# EAGLE design hasp_interface (EAGLE 9.6.2)

## Sheet 1 of 2: INTERFACE / PWR
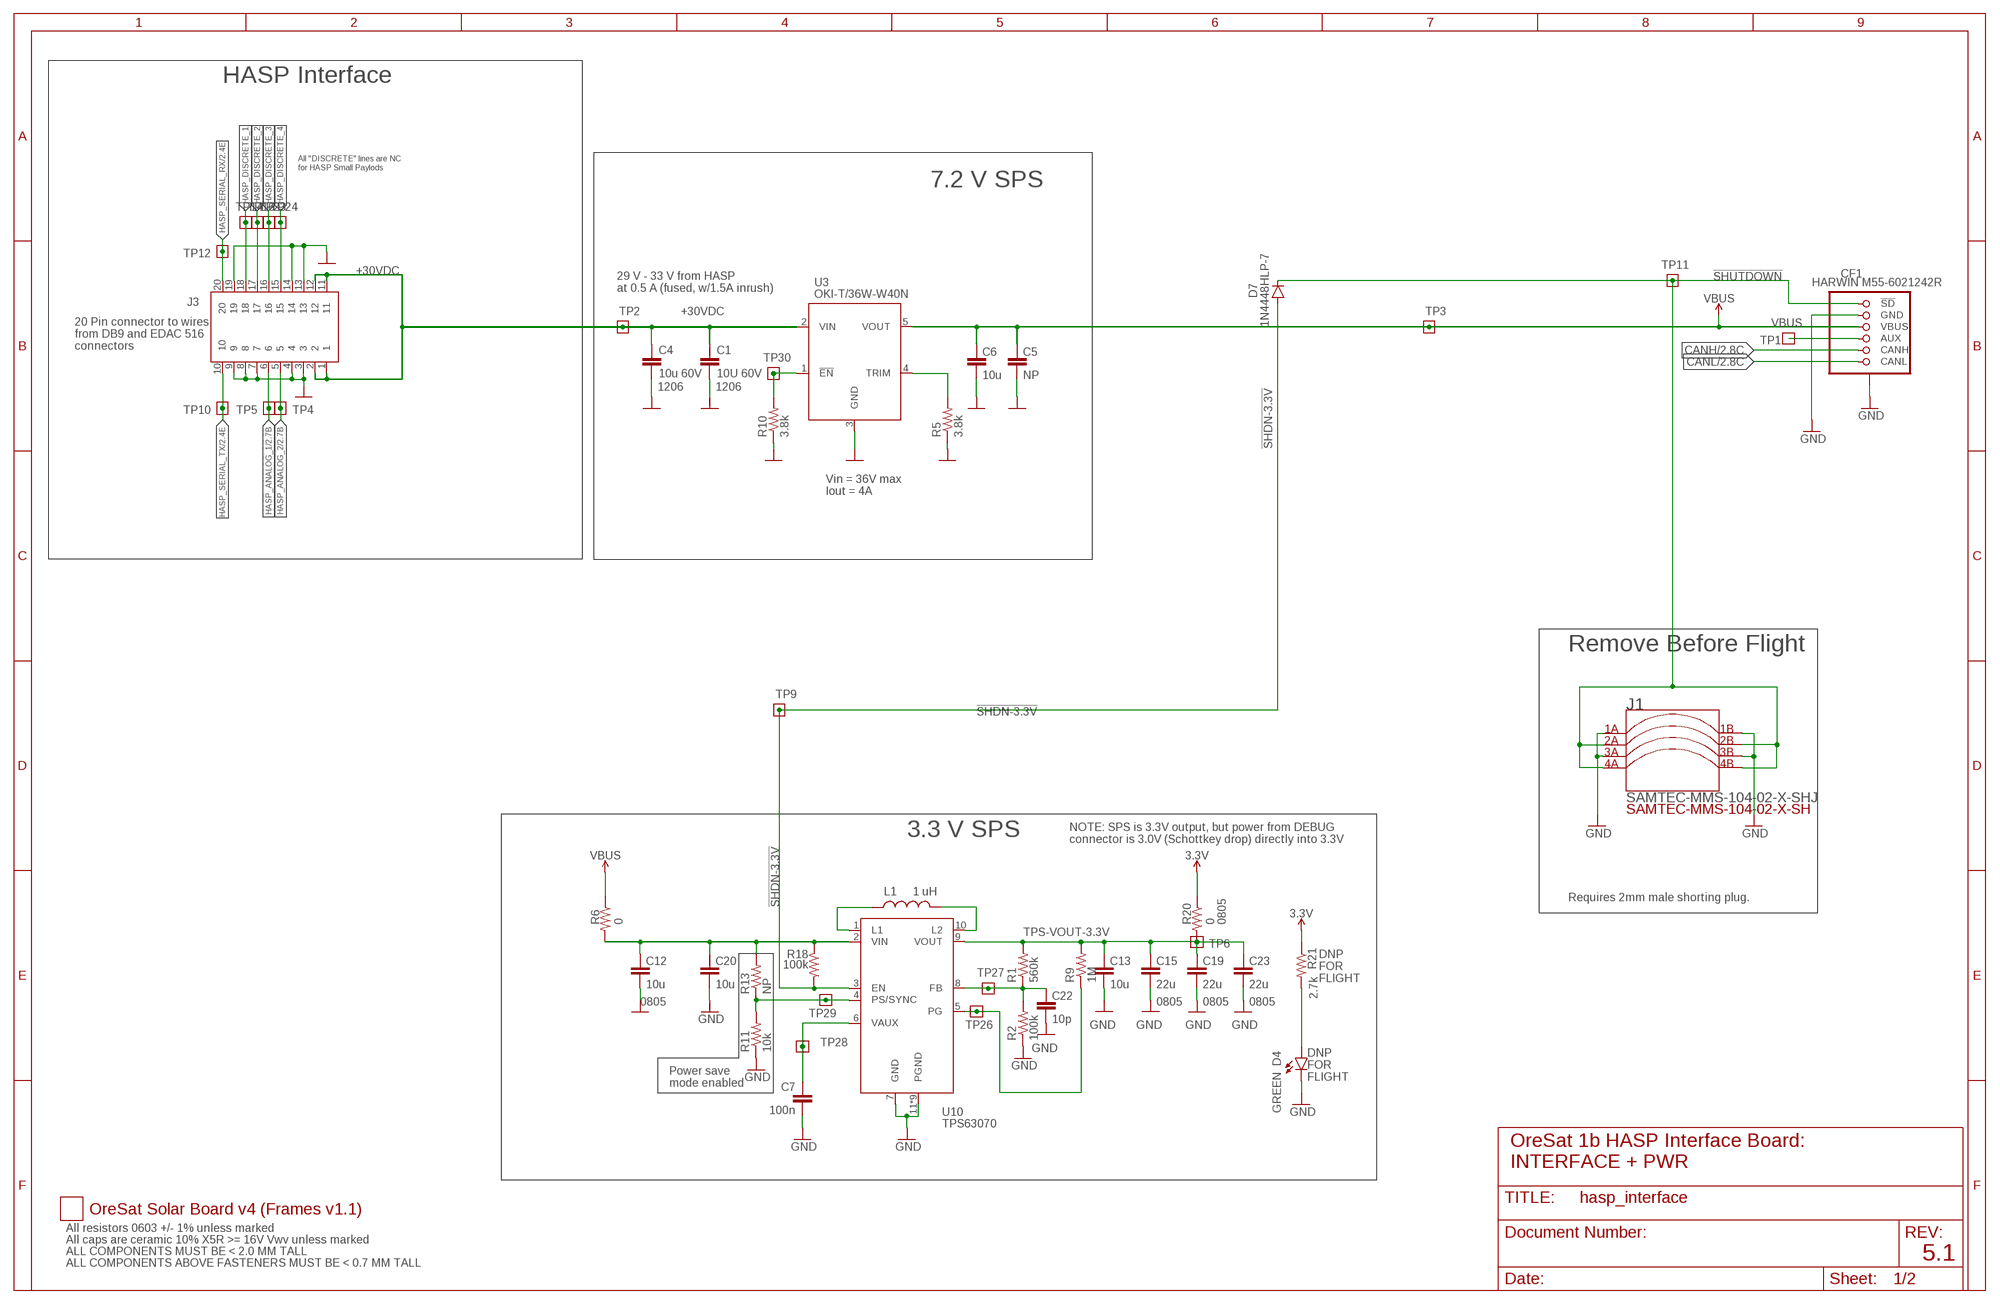
[diagram p0: schematic, sheet 1]

### Parts
C1  10U 60V  C-EU1206-C  [1206-C]
C4  10u 60V  C-EU1206-C  [1206-C]
C5  NP  C-EU0603-C-NOSILK  [.0603-C-NOSILK]
C6  10u  C-EU0603-C-NOSILK  [.0603-C-NOSILK]
C7  100n  C-EU0603-C-NOSILK  [.0603-C-NOSILK]
C12  10u  C-EU0805-B-NOSILK  [.0805-B-NOSILK]
C13  10u  C-EU0603-C-NOSILK  [.0603-C-NOSILK]
C15  22u  C-EU0805-B-NOSILK  [.0805-B-NOSILK]
C19  22u  C-EU0805-B-NOSILK  [.0805-B-NOSILK]
C20  10u  C-EU0603-C-NOSILK  [.0603-C-NOSILK]
C22  10p  C-EU0603-C-NOSILK  [.0603-C-NOSILK]
C23  22u  C-EU0805-B-NOSILK  [.0805-B-NOSILK]
CF1  HARWIN M55-6021242R  SOLAR-BOARD-CONNECTOR  [HARWIN-M55-60X1242R]
D4  GREEN  LED-GREEN0603  [LED-0603]
D7  1N4448HLP-7  D-0402  [.0402-B-NOSILK-DIODE]
J1  SAMTEC-MMS-104-02-X-SHJ  [SAMTEC-MMS-104-02-X-SH]
J3  MOLEX-43045XXXXRIGHTANGLE  [0430452000]
L1  1 uH  L-MURATA-1226AS-H-1R0N=P2  [IND_1226AS-H-1R0N=P2]
PCB1  ORESAT-SOLAR-BOARD-V4-SPECTROLABS  [ORESAT-SOLAR-BOARD-V4]
R1  560k  R-US_0603-C-NOSILK  [.0603-C-NOSILK]
R2  100k  R-US_0603-C-NOSILK  [.0603-C-NOSILK]
R5  3.8k  R-US_0603-C-NOSILK  [.0603-C-NOSILK]
R6  0  R-US_0805-C-NOSILK  [.0805-C-NOSILK]
R9  1M  R-US_0603-C-NOSILK  [.0603-C-NOSILK]
R10  3.8k  R-US_0603-C-NOSILK  [.0603-C-NOSILK]
R11  10k  R-US_0603-C-NOSILK  [.0603-C-NOSILK]
R13  NP  R-US_0603-C-NOSILK  [.0603-C-NOSILK]
R18  100k  R-US_0603-C-NOSILK  [.0603-C-NOSILK]
R20  0  R-US_0805-C-NOSILK  [.0805-C-NOSILK]
R21  2.7k  R-US_0603-C-NOSILK  [.0603-C-NOSILK]
TP1  TEST-POINT-LARGE-SQUARE  [1X01]
TP2  TEST-POINT-LARGE-SQUARE  [1X01]
TP3  TEST-POINT-LARGE-SQUARE  [1X01]
TP4  TEST-POINT-LARGE-SQUARE  [1X01]
TP5  TEST-POINT-LARGE-SQUARE  [1X01]
TP6  TEST-POINT-LARGE-SQUARE  [1X01]
TP9  TEST-POINT-LARGE-SQUARE  [1X01]
TP10  TEST-POINT-LARGE-SQUARE  [1X01]
TP11  TEST-POINT-LARGE-SQUARE  [1X01]
TP12  TEST-POINT-LARGE-SQUARE  [1X01]
TP14  TEST-POINT-LARGE-SQUARE  [1X01]
TP16  TEST-POINT-LARGE-SQUARE  [1X01]
TP23  TEST-POINT-LARGE-SQUARE  [1X01]
TP24  TEST-POINT-LARGE-SQUARE  [1X01]
TP26  TEST-POINT-LARGE-SQUARE  [1X01]
TP27  TEST-POINT-LARGE-SQUARE  [1X01]
TP28  TEST-POINT-LARGE-SQUARE  [1X01]
TP29  TEST-POINT-LARGE-SQUARE  [1X01]
TP30  TEST-POINT-LARGE-SQUARE  [1X01]
U3  OKI-T/36W-W40N  OKI-T/36W-W40  [OKI-T/36W-W40]
U10  TPS63070  U-TI-TPS63060DCT-BUCKBOOST  [CONV_TPS63060DSCT]

### Nets
3.3V: R20.1 R21.1 ; also sheet 2
!SHDN-3.3V: D7.A R18.2 TP9.1 U10.3(EN)
!SHUTDOWN: CF1.1(!SD) CF1.2(!SD) D7.C J1.2A J1.2B J1.4A J1.4B TP11.1
+30VDC: C1.1 C4.1 J3.1 J3.2 J3.11 J3.12 TP2.1 U3.2(VIN)
AUX: CF1.7(AUX) CF1.8(AUX) TP1.1
CANH: CF1.9(CANH) CF1.10(CANH) ; also sheet 2
CANL: CF1.11(CANL) CF1.12(CANL) ; also sheet 2
GND: C1.2 C4.2 C5.2 C6.2 C7.2 C12.2 C13.2 C15.2 C19.2 C20.2 C22.2 C23.2 CF1.3(GND) CF1.4(GND) CF1.P$1(SHIELD) CF1.P$2(SHIELD) CF1.P$3(SHIELD) CF1.P$4(SHIELD) D4.C J1.1A J1.1B J1.3A J1.3B J3.3 J3.4 J3.7 J3.8 J3.9 J3.13 J3.14 J3.19 R2.1 R5.1 R10.1 R11.1 U3.3(GND) U10.7(GND) U10.11(PGND) U10.12(PGND) U10.13(PGND) U10.14(PGND) U10.15(PGND) U10.16(PGND) U10.17(PGND) U10.18(PGND) U10.19(PGND) ; also sheet 2
HASP_ANALOG_1: J3.6 TP5.1 ; also sheet 2
HASP_ANALOG_2: J3.5 TP4.1 ; also sheet 2
HASP_DISCRETE_1: J3.18 TP14.1
HASP_DISCRETE_2: J3.17 TP16.1
HASP_DISCRETE_3: J3.16 TP23.1
HASP_DISCRETE_4: J3.15 TP24.1
HASP_SERIAL_RX: J3.20 TP12.1 ; also sheet 2
HASP_SERIAL_TX: J3.10 TP10.1 ; also sheet 2
N$2: R5.2 U3.4(TRIM)
N$5: R10.2 TP30.1 U3.1(!EN)
N$14: D4.A R21.2
TPS-EN: R11.2 R13.1 TP29.1 U10.4(PS/SYNC)
TPS-FB: C22.1 R1.1 R2.2 TP27.1 U10.8(FB)
TPS-L1: L1.1 U10.1(L1)
TPS-L2: L1.2 U10.10(L2)
TPS-PG: R9.1 TP26.1 U10.5(PG)
TPS-VAUX: C7.1 TP28.1 U10.6(VAUX)
TPS-VIN: C12.1 C20.1 R6.2 R13.2 R18.1 U10.2(VIN)
TPS-VOUT-3.3V: C13.1 C15.1 C19.1 C23.1 R1.2 R9.2 R20.2 TP6.1 U10.9(VOUT)
VBUS: C5.1 C6.1 CF1.5(VBUS) CF1.6(VBUS) R6.1 TP3.1 U3.5(VOUT)

### Notes on the sheet
- HASP Interface
- All "DISCRETE" lines are NC
  for HASP Small Paylods
- 7.2 V SPS
- 29 V - 33 V from HASP
  at 0.5 A (fused, w/1.5A inrush)
- OKI-T/36W-W40N
- 20 Pin connector to wires 
  from DB9 and EDAC 516 
  connectors
- 1206 | 1206
- Vin = 36V max
  Iout = 4A
- Remove Before Flight
- 3.3 V SPS
- NOTE: SPS is 3.3V output, but power from DEBUG
  connector is 3.0V (Schottkey drop) directly into 3.3V
- Requires 2mm male shorting plug.
- 0805
- DNP
  FOR
  FLIGHT
- 0805 | 0805 | 0805 | 0805
- DNP
  FOR
  FLIGHT
- Power save
  mode enabled
- OreSat 1b HASP Interface Board:
  INTERFACE + PWR
- All resistors 0603 +/- 1% unless marked
- All caps are ceramic 10% X5R >= 16V Vwv unless marked
- ALL COMPONENTS MUST BE < 2.0 MM TALL
- 5.1
- ALL COMPONENTS ABOVE FASTENERS MUST BE < 0.7 MM TALL

## Sheet 2 of 2: Microcontroller
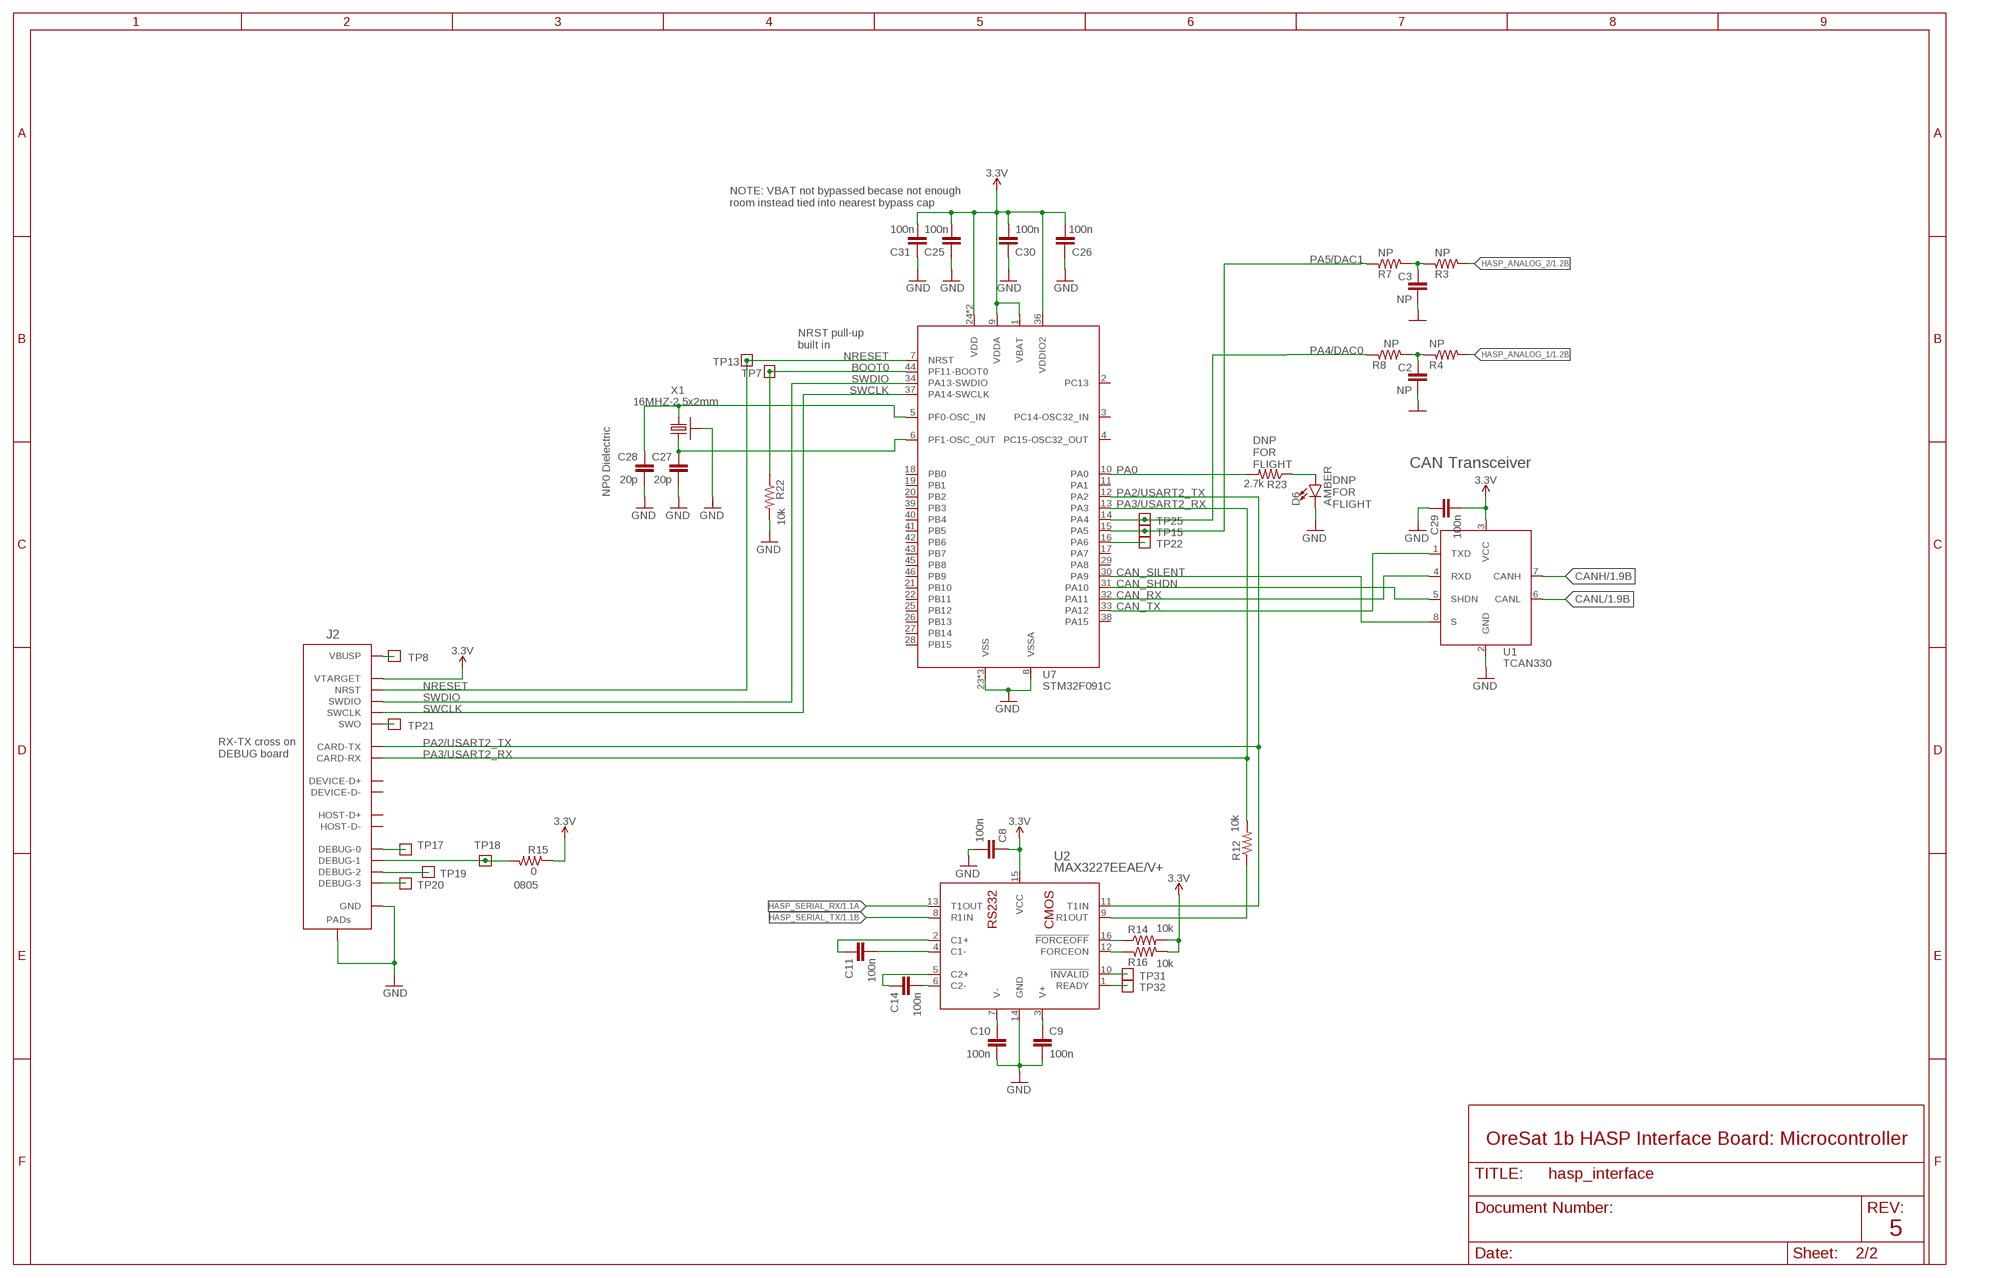
[diagram p1: schematic, sheet 2]

### Parts
C2  NP  C-EU0603-C-NOSILK  [.0603-C-NOSILK]
C3  NP  C-EU0603-C-NOSILK  [.0603-C-NOSILK]
C8  100n  C-EU0603-C-NOSILK  [.0603-C-NOSILK]
C9  100n  C-EU0603-C-NOSILK  [.0603-C-NOSILK]
C10  100n  C-EU0603-C-NOSILK  [.0603-C-NOSILK]
C11  100n  C-EU0603-C-NOSILK  [.0603-C-NOSILK]
C14  100n  C-EU0603-C-NOSILK  [.0603-C-NOSILK]
C25  100n  C-EU0603-C-NOSILK  [.0603-C-NOSILK]
C26  100n  C-EU0603-C-NOSILK  [.0603-C-NOSILK]
C27  20p  C-EU0603-C-NOSILK  [.0603-C-NOSILK]
C28  20p  C-EU0603-C-NOSILK  [.0603-C-NOSILK]
C29  100n  C-EU0603-C-NOSILK  [.0603-C-NOSILK]
C30  100n  C-EU0603-C-NOSILK  [.0603-C-NOSILK]
C31  100n  C-EU0603-C-NOSILK  [.0603-C-NOSILK]
D6  AMBER  LED-GREEN0603  [LED-0603]
J2  ORESAT-DEBUG-CONNECTOR-ALL  [TE_2-1734592-0]
R3  NP  R-US_0603-C-NOSILK  [.0603-C-NOSILK]
R4  NP  R-US_0603-C-NOSILK  [.0603-C-NOSILK]
R7  NP  R-US_0603-C-NOSILK  [.0603-C-NOSILK]
R8  NP  R-US_0603-C-NOSILK  [.0603-C-NOSILK]
R12  10k  R-US_0603-C-NOSILK  [.0603-C-NOSILK]
R14  10k  R-US_0603-C-NOSILK  [.0603-C-NOSILK]
R15  0  R-US_0805-C-NOSILK  [.0805-C-NOSILK]
R16  10k  R-US_0603-C-NOSILK  [.0603-C-NOSILK]
R22  10k  R-US_0603-C-NOSILK  [.0603-C-NOSILK]
R23  2.7k  R-US_0603-C-NOSILK  [.0603-C-NOSILK]
TP7  TEST-POINT-LARGE-SQUARE  [1X01]
TP8  TEST-POINT-LARGE-SQUARE  [1X01]
TP13  TEST-POINT-LARGE-SQUARE  [1X01]
TP15  TEST-POINT-LARGE-SQUARE  [1X01]
TP17  TEST-POINT-LARGE-SQUARE  [1X01]
TP18  TEST-POINT-LARGE-SQUARE  [1X01]
TP19  TEST-POINT-LARGE-SQUARE  [1X01]
TP20  TEST-POINT-LARGE-SQUARE  [1X01]
TP21  TEST-POINT-LARGE-SQUARE  [1X01]
TP22  TEST-POINT-LARGE-SQUARE  [1X01]
TP25  TEST-POINT-LARGE-SQUARE  [1X01]
TP31  TEST-POINT-LARGE-SQUARE  [1X01]
TP32  TEST-POINT-LARGE-SQUARE  [1X01]
U1  TCAN330  [SOT23-8_TI-DCN]
U2  MAX3227EEAE/V+  [21-0056_A16+2_MXM]
U7  STM32F091C  [STM32F091C]
X1  16MHZ-2.5x2mm  CRYSTAL-WITH-GND  [CRYSTAL_2.5X2]

### Nets
3.3V: C8.1 C25.2 C26.2 C29.2 C30.2 C31.2 J2.11(VTARGET) R14.2 R15.1 R16.2 U1.3(VCC) U2.15(VCC) U7.1(VBAT) U7.9(VDDA) U7.24(VDD) U7.36(VDDIO2) U7.48(VDD) ; also sheet 1
BOOT0: R22.1 TP7.1 U7.44(PF11-BOOT0)
CAN_RX: U1.4(RXD) U7.32(PA11)
CAN_SHDN: U1.5(SHDN) U7.31(PA10)
CAN_SILENT: U1.8(S) U7.30(PA9)
CAN_TX: U1.1(TXD) U7.33(PA12)
CANH: U1.7(CANH) ; also sheet 1
CANL: U1.6(CANL) ; also sheet 1
DEBU-1/SOLAR3V: J2.18(DEBUG-1) R15.2 TP18.1
DEBUG-0: J2.17(DEBUG-0) TP17.1
DEBUG-2: J2.19(DEBUG-2) TP19.1
DEBUG-3: J2.20(DEBUG-3) TP20.1
GND: C2.2 C3.2 C8.2 C9.2 C10.2 C25.1 C26.1 C27.2 C28.2 C29.1 C30.1 C31.1 D6.C J2.3(GND) J2.6(GND) J2.9(GND) J2.PAD1(PAD) J2.PAD2(PAD) R22.2 U1.2(GND) U2.14(GND) U7.8(VSSA) U7.23(VSS) U7.35(VSS) U7.47(VSS) X1.2(SHIELD) X1.4(SHIELD) ; also sheet 1
HASP_ANALOG_1: R4.2 ; also sheet 1
HASP_ANALOG_2: R3.2 ; also sheet 1
HASP_SERIAL_RX: U2.13(T1OUT) ; also sheet 1
HASP_SERIAL_TX: U2.8(R1IN) ; also sheet 1
N$1: J2.1(VBUSP) J2.2(VBUSP) TP8.1
N$3: C3.1 R3.1 R7.2
N$4: C2.1 R4.1 R8.2
N$6: R14.1 U2.16(!FORCEOFF)
N$7: C10.1 U2.7(V-)
N$8: C9.1 U2.3(V+)
N$9: C14.2 U2.6(C2-)
N$10: C14.1 U2.5(C2+)
N$11: C11.2 U2.4(C1-)
N$12: C11.1 U2.2(C1+)
N$13: R12.1 U2.9(R1OUT)
N$15: R16.1 U2.12(FORCEON)
N$17: TP31.1 U2.10(!INVALID)
N$18: TP32.1 U2.1(READY)
N$19: D6.A R23.1
NRESET: J2.10(NRST) TP13.1 U7.7(NRST)
PA0: R23.2 U7.10(PA0)
PA2/USART2_TX: J2.13(CARD-TX) U2.11(T1IN) U7.12(PA2)
PA3/USART2_RX: J2.12(CARD-RX) R12.2 U7.13(PA3)
PA4/DAC0: R8.1 TP25.1 U7.14(PA4)
PA5/DAC1: R7.1 TP15.1 U7.15(PA5)
PA6: TP22.1 U7.16(PA6)
SWCLK: J2.15(SWCLK) U7.37(PA14-SWCLK)
SWDIO: J2.14(SWDIO) U7.34(PA13-SWDIO)
SWO: J2.16(SWO) TP21.1
XTAL1-IN: C28.1 U7.5(PF0-OSC_IN) X1.1
XTAL1-OUT: C27.1 U7.6(PF1-OSC_OUT) X1.3
Unconnected: J2.4(DEVICE-D+) J2.5(DEVICE-D-) J2.7(HOST-D+) J2.8(HOST-D-) U7.2(PC13) U7.3(PC14-OSC32_IN) U7.4(PC15-OSC32_OUT) U7.11(PA1) U7.17(PA7) U7.18(PB0) U7.19(PB1) U7.20(PB2) U7.21(PB10) U7.22(PB11) U7.25(PB12) U7.26(PB13) U7.27(PB14) U7.28(PB15) U7.29(PA8) U7.38(PA15) U7.39(PB3) U7.40(PB4) U7.41(PB5) U7.42(PB6) U7.43(PB7) U7.45(PB8) U7.46(PB9)

### Notes on the sheet
- NOTE: VBAT not bypassed becase not enough 
  room instead tied into nearest bypass cap
- NRST pull-up
  built in
- CAN Transceiver
- DNP
  FOR
  FLIGHT
- NP0 Dielectric
- DNP
  FOR
  FLIGHT
- RX-TX cross on
  DEBUG board
- 0805
- OreSat 1b HASP Interface Board: Microcontroller
- 5

## Library data of the parts
C1 C4 = oresat-rcl:C-EU: CAPACITOR, European symbol
C2 C3 C5 C6 C13 C20 C22 = oresat-rcl:C-EU: CAPACITOR, European symbol; DIS: Digi-Key; DPN: 490-12317-1-ND; MFR: Murata; MPN: GRT188R61C106KE13D
C7-C11 C14 C25 C26 C29-C31 = oresat-rcl:C-EU: CAPACITOR, European symbol; DIS: Digi-Key; DPN: 1276-6985-1-ND; MFR: Kemet; MPN: CL10B104KB85PND
C12 = oresat-rcl:C-EU: CAPACITOR, European symbol; DIS: Digi-Key; DPN: 490-12379-2-ND; MFR: Murata; MPN: GRT21BR61C106KE01L
C15 C19 C23 = oresat-rcl:C-EU: CAPACITOR, European symbol; DIS: Digi-Key; DPN: 1276-6817-1-ND; MFR: Samsung; MPN: CL32B226KOJVPNE
C27 C28 = oresat-rcl:C-EU: CAPACITOR, European symbol; DIS: Digi-Key; DPN: 490-11157-2-ND; MFR: Murata; MPN: GCM1885C2A200JA16D
CF1 = J-Harwin-M55-60X1242R-Solar-board-connector:SOLAR-BOARD-CONNECTOR: OreSat Solar Board Connector This 12 pin 1.27 mm vertical connector (Harwin M55-6021242R) is used on the OreSat 1U solar panels to connect to the end cards.; DIS: DIGIKEY; DPN: M55-6021242R; MFR: HARWIN; MPN: M55-6021242R
D4 = SparkFun-LED:LED-GREEN: Green SMD LED Used in manufacturing of various products at SparkFun Packages: 0603 - SMD 0603 package [Product Link] <http://www.futureelectronics.com/en/technologies/semiconductors/optoelectronics/leds/Pages/9894312-LTST-C190GKT.aspx?CrossPart=HSMG-C190&IM=0> LilyPad 1206 - SMD1206 LilyPad package [Product Link] <http://www.futureelectronics.com/en/Technologies/Product.aspx?ProductID=IN150NGHARVATEKCORPORATION2049943&IM=0> 1206 - SMD1206 package [Product Link] <http://www.futureelectronics.com/en/technologies/semiconductors/optoelectronics/leds/Pages/8315665-LTST-C150KGKT.aspx?IM=0> 1206 Bottom Mount -SMD 1206 Bottom Mount [Product Link] <http://www.digikey.com/product-detail/en/lite-on-inc/LTST-C230KGKT/160-1456-1-ND/386854> SparkFun Products: Pro Mini 328 -5V <https://www.sparkfun.com/products/821> RedBoard <https://www.sparkfun.com/products/12757> MP3 Trigger <https://www.sparkfun.com/products/13720> Makey Makey <https://www.sparkfun.com/products/11076>; DIS: Digi-Key; DPN: 1830-1064-1-ND; MFR: Inolux; MPN: IN-S63AT5A
D6 = SparkFun-LED:LED-GREEN: Green SMD LED Used in manufacturing of various products at SparkFun Packages: 0603 - SMD 0603 package [Product Link] <http://www.futureelectronics.com/en/technologies/semiconductors/optoelectronics/leds/Pages/9894312-LTST-C190GKT.aspx?CrossPart=HSMG-C190&IM=0> LilyPad 1206 - SMD1206 LilyPad package [Product Link] <http://www.futureelectronics.com/en/Technologies/Product.aspx?ProductID=IN150NGHARVATEKCORPORATION2049943&IM=0> 1206 - SMD1206 package [Product Link] <http://www.futureelectronics.com/en/technologies/semiconductors/optoelectronics/leds/Pages/8315665-LTST-C150KGKT.aspx?IM=0> 1206 Bottom Mount -SMD 1206 Bottom Mount [Product Link] <http://www.digikey.com/product-detail/en/lite-on-inc/LTST-C230KGKT/160-1456-1-ND/386854> SparkFun Products: Pro Mini 328 -5V <https://www.sparkfun.com/products/821> RedBoard <https://www.sparkfun.com/products/12757> MP3 Trigger <https://www.sparkfun.com/products/13720> Makey Makey <https://www.sparkfun.com/products/11076>; DIS: Digi-Key; DPN: 1830-1064-1-ND; MFR: Inolux; MPN: IN-S63AT5A; VALUE: GREEN
D7 = D-0402-package:D-0402; DIS: Digi-Key; DPN: 1N4448HLPDICT-ND; MFR: Diodes Inc; MPN: 1N4448HLP-7
J1 = J-Samtec-MMS-104-02-X-SH-smt-0.1-ra:SAMTEC-MMS-104-02-X-SH
J2 = oresat-debug-connector:ORESAT-DEBUG-CONNECTOR; DIS: Digi-Key; DPN: 732-11341-1-ND; MFR: Wurth; MPN: 687120183622
J3 = J-Molex-043045XXXX-Dual-Row-Connector:MOLEX-43045XXXX
L1 = L-Wurth-1226ASH1R0NP2:L-MURATA-1226AS-H-1R0N=P2; DIS: Digi-Key; DPN: 445-VLS3010CX-1R5M-1CT-ND; MFR: TDK; MPN: VLS3010CX-1R5M-1
PCB1 = oresat-solar-board:ORESAT-SOLAR-BOARD-V4
R1 = oresat-rcl:R-US_: RESISTOR, American symbol; DIS: Digi-Key; DPN: A129720CT-ND; MFR: TE; MPN: CRGCQ0603F470K
R2 = oresat-rcl:R-US_: RESISTOR, American symbol; DIS: Digi-Key; DPN: RR08P100KDCT-ND; MFR: Susumu; MPN: RR0816P-104-D
R3-R5 R7-R11 = oresat-rcl:R-US_: RESISTOR, American symbol
R6 R15 R20 = oresat-rcl:R-US_: RESISTOR, American symbol; DIS: Digi-Key; DPN: RMCF0805ZT0R00CT-ND; MFR: Stackpole; MPN: RMCF0805ZT0R00
R12 R14 R16 R21-R23 = oresat-rcl:R-US_: RESISTOR, American symbol; DIS: Digi-Key; DPN: A129693CT-ND; MFR: TE; MPN: CRGCQ0603F2K7
R13 R18 = oresat-rcl:R-US_: RESISTOR, American symbol; DIS: Digi-Key; DPN: RNCP0603FTD10K0CT-ND; MFR: Stackpole; MPN: RNCP0603FTD10K0
TP1-TP32 = oresat-misc:TEST-POINT-LARGE-SQUARE
U1 = TCAN330:TCAN330; DIS: Digi-Key; DPN: 296-44211-1-ND; MFR: Texas Instruments; MPN: TCAN330GDCNT
U2 = U-Maxim-MAX3227-RS232-transceiver-driver:MAX3227EEAE/V+; BUILT_BY: EMA_UL_Team; MANUFACTURER_PART_NUMBER: MAX3227EEAE/V+; REVISION: 4; SOURCELIBRARY: Update_to_database_2021-06-01; VENDOR: Maxim Integrated Products
U3 = U-Murata-OKI-T36-W40-DC-DC-Converter:OKI-T/36W-W40
U7 = U-ST-STM32F091C-uC:STM32F091C; DIS: Digi-Key; DPN: 497-18749-1-ND; MFR: STMicroelectronics; MPN: STM32F091CCT6TR
U10 = U-TI-TPS63060DSCT-buck-boost:U-TI-TPS63060DCT-BUCKBOOST; DIS: Digi-Key; DPN: 296-44764-1-ND; MFR: Texas Instruments; MPN: TPS63070RNMT
X1 = low-gain-radio:CRYSTAL-WITH-GND; DIS: Digi-Key; DPN: XC2181CT-ND; MFR: ECS Inc.; MPN: ECS-160-10-36Q-ES-TR

## Board
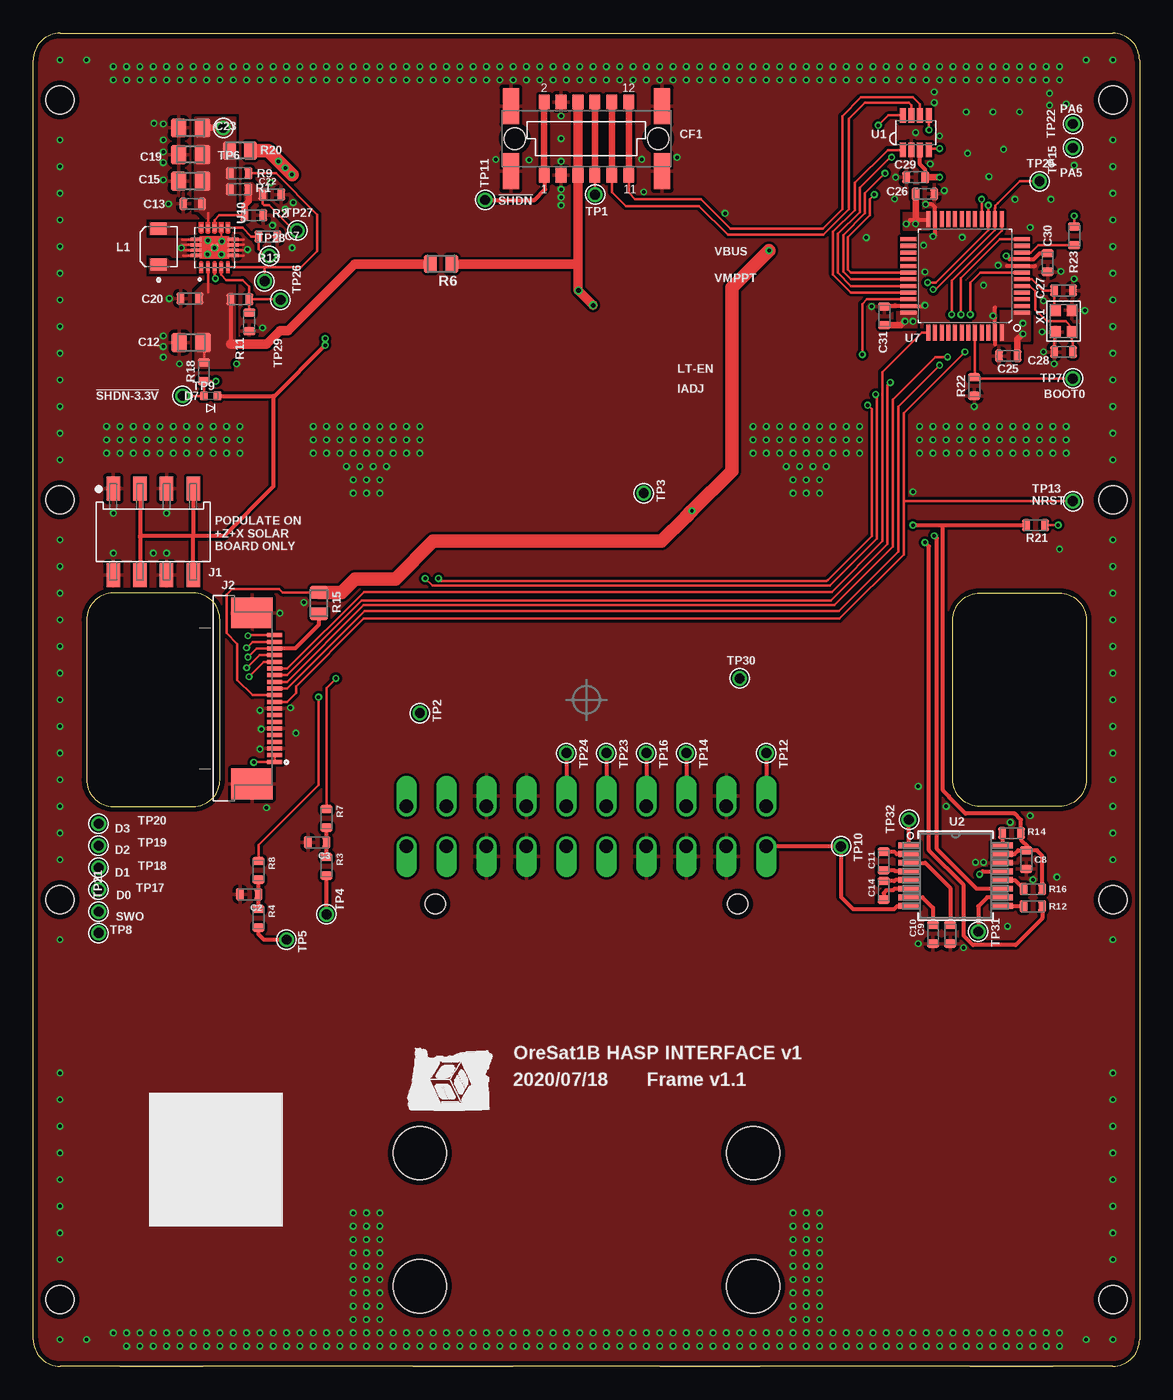
[diagram p2: board, top side]
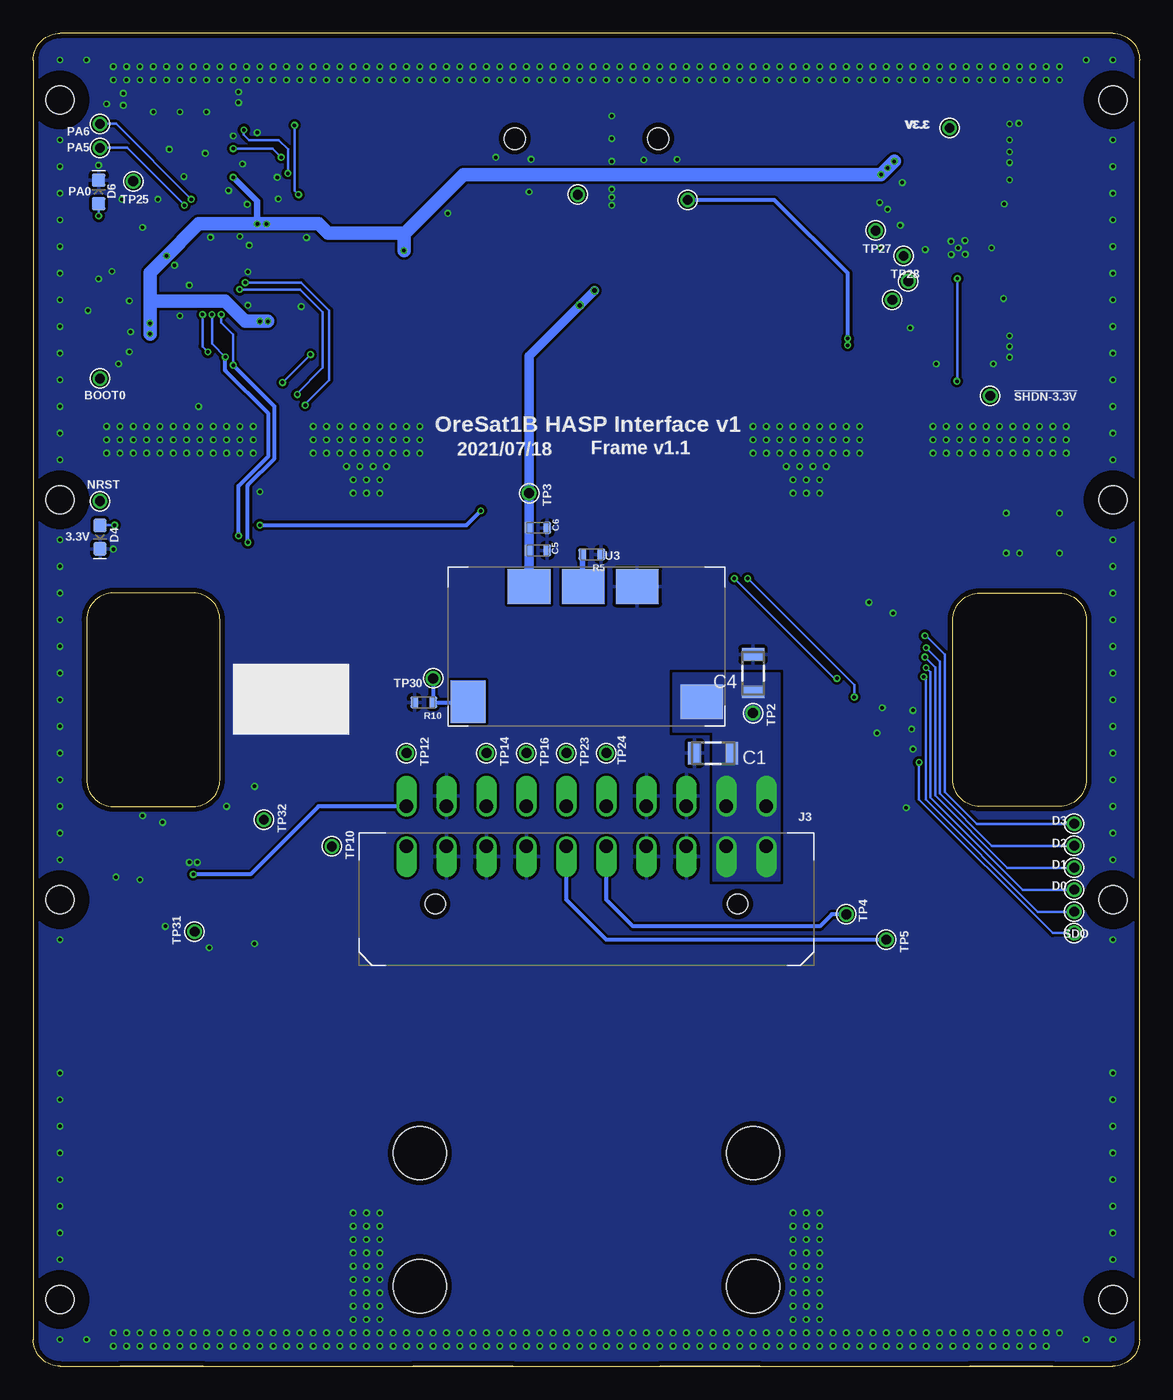
[diagram p3: board, bottom side, seen from below]

Size 83 x 100 mm. Coordinates in mm from the lower left corner, seen from the top.
Copper layers (1*16): Top 0.035559375mm / dielectric 1.6mm / Bottom 0.035559375mm
Design rules "oshpark-2layer-tented": minimum track width 6mil, minimum drill 10mil, track to track 6mil, track to pad 6mil, pad to pad 6mil, via to via 6mil, smd to smd 6mil, copper to edge 15mil, drill to drill 6mil, minimum pad ring 5mil, minimum via ring 5mil, stop-mask expansion 2.5mil, vias tented up to drill 20mil, thermal gap 10mil
Holes 4 mm at 29,6 54,6 54,16 29,16

### Footprints (pad centres in the part's own frame; a part is rotated, then mirrored left to right if it is on the bottom)
1206-C = smd 0.95 x 1.7: 1 -1.4,0; 2 1.4,0
.0603-C-NOSILK = smd 0.6 x 0.9: 1 -0.7,0; 2 0.7,0
.0805-B-NOSILK = smd 1.15 x 1.45: 1 -0.9,0; 2 0.9,0
HARWIN-M55-60X1242R = smd 0.8 x 1.1: 1 -3.175,-2.75; 2 -3.175,2.75; 3 -1.905,-2.75; 4 -1.905,2.75; 5 -0.635,-2.75; 6 -0.635,2.75; 7 0.635,-2.75; 8 0.635,2.75; 9 1.905,-2.75; 10 1.905,2.75; 11 3.175,-2.75; 12 3.175,2.75 | smd 1.2 x 2.7: P$1 -5.67,-2.45; P$2 -5.67,2.45; P$3 5.67,2.45; P$4 5.67,-2.45 | hole 1.6: -5.385,0; 5.385,0
LED-0603 = smd 1 x 1: A -0.877,0; C 0.877,0
.0402-B-NOSILK-DIODE = smd 0.6 x 0.7: A -0.5,0; C 0.5,0
SAMTEC-MMS-104-02-X-SH = smd 1.02 x 1.78: 1A -3,3.24; 1B -3,-3.24; 2A -1,3.24; 2B -1,-3.24; 3A 1,3.24; 3B 1,-3.24; 4A 3,3.24; 4B 3,-3.24
TE_2-1734592-0 = smd 0.3 x 1.1: 1 -4.75,-1.7; 2 -4.25,-1.7; 3 -3.75,-1.7; 4 -3.25,-1.7; 5 -2.75,-1.7; 6 -2.25,-1.7; 7 -1.75,-1.7; 8 -1.25,-1.7; 9 -0.75,-1.7; 10 -0.25,-1.7; 11 0.25,-1.7; 12 0.75,-1.7; 13 1.25,-1.7; 14 1.75,-1.7; 15 2.25,-1.7; 16 2.75,-1.7; 17 3.25,-1.7; 18 3.75,-1.7; 19 4.25,-1.7; 20 4.75,-1.7 | smd 2.3 x 3.1: PAD1 6.42,0; PAD2 -6.42,0
0430452000 = drill 1.02 offset: 1 13.5,-1.5; 2 10.5,-1.5; 3 7.5,-1.5; 4 4.5,-1.5; 5 1.5,-1.5; 6 -1.5,-1.5; 7 -4.5,-1.5; 8 -7.5,-1.5; 9 -10.5,-1.5; 10 -13.5,-1.5; 11 13.5,1.5; 12 10.5,1.5; 13 7.5,1.5; 14 4.5,1.5; 15 1.5,1.5; 16 -1.5,1.5; 17 -4.5,1.5; 18 -7.5,1.5; 19 -10.5,1.5; 20 -13.5,1.5 | hole 1.5: -11.35,-5.82; 11.35,-5.82
IND_1226AS-H-1R0N=P2 = smd 0.9 x 1.2: 1 -1.35,0; 2 1.35,0
ORESAT-SOLAR-BOARD-V4 = hole 2.1: 2,5; 2,35; 2,95; 81,5; 81,35; 81,95; 2,65; 81,65
.0805-C-NOSILK = smd 0.95 x 1.35: 1 -0.8,0; 2 0.8,0
1X01 = drill 0.737 pad 1.1: 1 0,0
SOT23-8_TI-DCN = smd 0.45 x 1.1: 1 -0.975,-1.3; 2 -0.325,-1.3; 3 0.325,-1.3; 4 0.975,-1.3; 5 0.975,1.3; 6 0.325,1.3; 7 -0.325,1.3; 8 -0.975,1.3
21-0056_A16+2_MXM = smd 1.613 x 0.432: 1 -3.499,2.275; 2 -3.499,1.625; 3 -3.499,0.975; 4 -3.499,0.325; 5 -3.499,-0.325; 6 -3.499,-0.975; 7 -3.499,-1.625; 8 -3.499,-2.275; 9 3.499,-2.275; 10 3.499,-1.625; 11 3.499,-0.975; 12 3.499,-0.325; 13 3.499,0.325; 14 3.499,0.975; 15 3.499,1.625; 16 3.499,2.275
OKI-T/36W-W40 = smd 3.2 x 2.6: 1 -4.15,8.88 | smd 2.6 x 3.2: 2 -4.15,-8.64; 3 4.49,-3.81; 4 4.49,0.24; 5 4.49,4.31
STM32F091C = smd 0.3 x 1.2: 1 -2.75,-4.25; 2 -2.25,-4.25; 3 -1.75,-4.25; 4 -1.25,-4.25; 5 -0.75,-4.25; 6 -0.25,-4.25; 7 0.25,-4.25; 8 0.75,-4.25; 9 1.25,-4.25; 10 1.75,-4.25; 11 2.25,-4.25; 12 2.75,-4.25; 25 2.75,4.25; 26 2.25,4.25; 27 1.75,4.25; 28 1.25,4.25; 29 0.75,4.25; 30 0.25,4.25; 31 -0.25,4.25; 32 -0.75,4.25; 33 -1.25,4.25; 34 -1.75,4.25; 35 -2.25,4.25; 36 -2.75,4.25 | smd 1.2 x 0.3: 13 4.25,-2.75; 14 4.25,-2.25; 15 4.25,-1.75; 16 4.25,-1.25; 17 4.25,-0.75; 18 4.25,-0.25; 19 4.25,0.25; 20 4.25,0.75; 21 4.25,1.25; 22 4.25,1.75; 23 4.25,2.25; 24 4.25,2.75; 37 -4.25,2.75; 38 -4.25,2.25; 39 -4.25,1.75; 40 -4.25,1.25; 41 -4.25,0.75; 42 -4.25,0.25; 43 -4.25,-0.25; 44 -4.25,-0.75; 45 -4.25,-1.25; 46 -4.25,-1.75; 47 -4.25,-2.25; 48 -4.25,-2.75
CONV_TPS63060DSCT = smd 0.5 x 0.2: 1 -1.475,1; 2 -1.475,0.5; 3 -1.475,0; 4 -1.475,-0.5; 5 -1.475,-1; 6 1.475,-1; 7 1.475,-0.5; 8 1.475,0; 9 1.475,0.5; 10 1.475,1 | smd 0.5 x 0.5: 11 0,0 | smd 0.254 x 0.8: 12 -0.6,1.4; 13 -0.2,1.4; 14 0.2,1.4; 15 0.6,1.4; 16 -0.6,-1.4; 17 -0.2,-1.4; 18 0.2,-1.4; 19 0.6,-1.4
CRYSTAL_2.5X2 = smd 0.9 x 0.8: 1 -0.825,-0.625; 2 0.825,-0.625; 3 0.825,0.625; 4 -0.825,0.625

### Placement (x,y rotation side)
C1  32,46 180 bottom
C2  16.2,35.4 180 top
C3  21.3,39.3 180 top
C4  29,52 90 bottom
C5  45.15,61.2 0 bottom
C6  45.15,62.9 0 bottom
C7  17.6,84.75 0 top
C8  74.5,38 270 top
C9  68.8,32.4 270 top
C10  67.5,32.4 270 top
C11  63.8,37.9 270 top
C12  11.85,76.8 180 top
C13  11.95,87.2 180 top
C14  63.8,35.7 270 top
C15  11.8,88.9 180 top
C19  11.8,90.9 180 top
C20  11.75,80.1 180 top
C22  17.9,87.9 0 top
C23  11.8,92.9 180 top
C25  73.14,75.8 0 top
C26  66.9,87.95 180 top
C27  77.3,80.7 0 top
C28  77.3,76.1 180 top
C29  66.2,89.2 0 top
C30  76.1,82.8 90 top
C31  63.85,78.8 270 top
CF1  41.5,92.1 0 top
D4  78,62.2 270 bottom
D6  78.1,88.1 90 bottom
D7  13.3,72.8 0 top
J1  9,62.6 0 top
J2  16.4,50.1 90 top
J3  41.5,40.5 0 bottom
L1  9.4,84 90 top
PCB1  0,0 0 top
R1  15.45,88.3 180 top
R2  16.55,86.35 180 top
R3  22,37.5 270 top
R4  16.9,33.6 270 top
R5  41.1,60.9 180 bottom
R6  30.6,82.7 180 top
R7  22,41.1 270 top
R8  16.9,37.2 270 top
R9  15.45,89.5 180 top
R10  53.7,49.8 0 bottom
R11  16.2,78.35 90 top
R12  75,34.5 0 top
R13  15.5,80.05 180 top
R14  73.4,40 0 top
R15  21.43,57.25 270 top
R16  75,35.8 0 top
R18  12.8,74.6 270 top
R20  15.5,91.2 180 top
R21  75.2,63.1 0 top
R22  70.6,73.5 270 top
R23  78.1,84.8 270 top
TP1  42.15,87.9 90 top
TP2  29,49 270 top
TP3  45.8,65.5 270 top
TP4  22,33.9 270 top
TP5  19,32 270 top
TP6  14.25,92.9 180 top
TP7  78,74.1 0 top
TP8  4.9,32.5 0 top
TP9  11.2,72.8 0 top
TP10  60.6,39 270 top
TP11  33.9,87.5 0 top
TP12  55,46 270 top
TP13  78,64.9 180 top
TP14  49,46 270 top
TP15  78,91.4 0 top
TP16  46,46 270 top
TP17  4.9,35.75 270 top
TP18  4.9,37.4 270 top
TP19  4.9,39.05 270 top
TP20  4.9,40.7 270 top
TP21  4.9,34.1 90 top
TP22  78,93.2 0 top
TP23  43,46 270 top
TP24  40,46 270 top
TP25  75.5,88.9 0 top
TP26  17.35,81.4 180 top
TP27  19.8,85.2 0 top
TP28  17.7,83.3 0 top
TP29  18.55,80 180 top
TP30  53,51.6 0 top
TP31  70.9,32.6 270 top
TP32  65.7,41 270 top
U1  66.2,92.55 0 top
U2  69.2,36.8 0 top
U3  41.5,54 90 bottom
U7  69.9,81.8 90 top
U10  13.6,83.93 90 top
X1  77.3,78.4 90 top

### Tracks (layer width: path | path; a pad name or v marks a point on that pad's centre or on a via)
3.3V  (via drill 0.25)
  Top 0.2: J2.11 16.45,50.35 15.3,51.5 15.3,54.2 14.5,55 14.5,57.88 14.92,58.3 18.45,58.3 18.7,58.05 R15.1
  Top 0.3: C29.2 66.9,89.8 66.53,90.17 U1.3 | C30.2 75.5,83.5 75.05,83.05 U7.9 73.25,83.05 v73,83.3 | U7.24 67.1,86 65.8,86 v65.5,85.7 | v66,63.1 68.2,63.1 | 68.2,63.1 R21.1 | R16.2 75.7,38.3 75.3,38.7 74.6,38.7 | 74.6,38.7 C8.1 73.9,38.7 73.62,38.42 U2.15 | 74.6,38.7 74.6,39 74.1,39.5 R14.2 74.1,41 73.63,41.47 69.94,41.47 68.7,42.71 68.7,42.76 68.25,43.2 68.25,63.05 68.2,63.1
  Top 0.5: C31.2 65.1,78.1 v65.4,78.4 | C25.2 73.84,77.05 v74.25,77.45 | v68,89.2 C29.2 | C26.2 v66.2,85.7
  Top 1: R15.1 23.12,58.05 24.13,59.05 27.17,59.07 30,61.9 47.14,61.9 48.92,63.68 v49.42,64.18 52.4,67.16 52.4,80.9 v55.2,83.7 | R20.1 17.6,91.2 v18.4,90.4 v18.9,89.9 v19.4,89.4
  Bottom 0.3: v66,63.1 50.5,63.1 v49.42,64.18
  Bottom 0.5: 74.25,78.63 74.24,78.62 | 55.2,84.9 55.1,85 | v68,89.2 66.2,87.4 v66.2,85.7
  Bottom 0.6: v74.25,78.25 v74.24,78.26 74.24,78.62
  Bottom 1: v74.25,78.25 v74.25,77.45 74.25,79.9 68.6,79.9 67.1,78.4 v65.4,78.4 | v55.2,83.7 55.2,84.9 | 74.25,78.63 74.25,82.05 v73,83.3 70.85,85.45 70.6,85.7 v66.2,85.7 v65.5,85.7 61.6,85.7 60.9,85 55.1,85 50.72,89.38 19.42,89.38 v18.9,89.9 v18.4,90.4
  other vias: 66,78.4
  pour Top (no thermals): 67.2,86.55 67.2,85.25 65.3,85.25 65.3,86.55
  pour Top (isolate 0.2, no thermals): 72.5,76.95 74.8,76.95 74.8,79.15 72.5,79.15
  pour Top (isolate 0.2, no thermals): 64.8,79.15 64.8,77.95 66.3,77.95 66.3,79.15
!SHDN-3.3V  (via drill 0.25)
  Top 0.2: v13.7,73.9 R18.2 D7.A TP9.1 | v13.67,81.6 13.6,81.67 U10.3
  Bottom 0.2: v13.67,81.6 13.67,73.93 v13.7,73.9
!SHUTDOWN  (via drill 0.25)
  Top 0.2: 38.4,89.28 CF1.1 | 8.1,62.3 8.05,62.25 | 8.05,62.25 8,62.2 | 8,62.3 8.05,62.25 | 12,62.3 | J1.2B
  Top 0.3: D7.C 18,72.8 | 18,72.8 18.1,72.8 v21.9,76.6 v21.9,77.1 | TP11.1 37.6,87.5 38.4,88.3 38.4,89.28 | 18,72.8 18,66 14.3,62.3 12,62.3 | J1.4B 12,62.3 | J1.4A 12,62.3 | 12,62.3 8.1,62.3 | 8,62.2 J1.2B | J1.2A 8,62.3
  Top 0.5: CF1.2 CF1.1
  Bottom 0.3: v21.9,76.6 21.9,82 27.4,87.5 TP11.1
+30VDC
  pour Bottom (no thermals): 27,36.4 32,36.4 32,47.6 35,47.6 35,52 27,52
AUX
  Top 0.2: CF1.7 42.13,87.92 TP1.1
  Top 0.5: CF1.8 CF1.7
BOOT0
  Top 0.2: TP7.1 70.7,74.1 R22.1 70.65,74.25 U7.44
CAN_RX  (via drill 0.25)
  Top 0.2: v68,91.35 67.28,91.35 U1.4 | v64.4,90.7 64.3,90.7 62,88.4 62,86.6 60.38,84.97 60.38,82.03 61.35,81.05 U7.32
  Bottom 0.2: v64.4,90.7 65.05,91.35 v68,91.35
CAN_SHDN  (via drill 0.25)
  Top 0.2: U1.5 67.17,92.78 v67.2,92.75 | v63.9,89.5 62.4,88 62.4,86.5 60.77,84.88 60.77,82.12 61.35,81.55 U7.31
  Bottom 0.2: v63.9,89.5 63.9,90.48 63.89,90.49 63.89,91.29 64.6,92 66.8,92 67.2,92.4 v67.2,92.75
CAN_SILENT  (via drill 0.25)
  Top 0.2: U1.8 64.15,93.85 v63.4,93.1 | U7.30 61.35,82.05 61.13,82.28 61.13,84.7 62.77,86.35 62.77,87.57 v63.1,87.9
  Bottom 0.2: v63.1,87.9 63.39,88.19 v63.39,93.09 v63.4,93.1
CAN_TX
  Top 0.2: U1.1 64.1,91.25 61.64,88.79 61.64,86.74 60,85.1 60,81.9 61.35,80.55 U7.33
CANH
  Top 0.2: CF1.9 43.41,88.09 44.45,87.05 49.95,87.05 52.1,84.9 59.3,84.9 61.2,86.8 61.2,93.6 62.4,94.8 65.7,94.8 65.88,94.62 U1.7
  Top 0.5: CF1.10 CF1.9
CANL
  Top 0.2: CF1.11 44.67,88.03 45.15,87.55 50.1,87.55 52.3,85.35 59.25,85.35 60.7,86.8 60.7,93.8 62.1,95.2 66,95.2 66.53,94.67 U1.6
  Top 0.5: CF1.12 CF1.11
DEBU-1/SOLAR3V  (via drill 0.25)
  Top 0.2: v16.1,53.2 16.75,53.85 J2.18
  Top 0.3: J2.18 19.65,53.85 21.44,55.64 R15.2
  Bottom 0.2: TP18.1 9.92,37.4 15.33,42.81 15.33,52.43 v16.1,53.2
DEBUG-0  (via drill 0.25)
  Top 0.2: v16.01,52.39 16.97,53.35 J2.17
  Bottom 0.2: TP17.1 8.77,35.75 15.68,42.66 15.68,52.06 v16.01,52.39
DEBUG-2  (via drill 0.25)
  Top 0.2: v16,53.9 16.45,54.35 J2.19
  Bottom 0.2: TP19.1 11.07,39.05 14.97,42.95 14.97,52.88 v16,53.9
DEBUG-3  (via drill 0.25)
  Top 0.2: v16.1,54.8 16.15,54.85 J2.20
  Bottom 0.2: TP20.1 12.22,40.7 14.6,43.08 14.6,53.4 16,54.8 v16.1,54.8
GND  (via drill 0.25)
  Top 0.152: U10.7 14.1,83.9
  Top 0.2: C28.2 76.6,77.5 X1.4 | 11.22,84.13 U10.14 | U10.12 11.23,83.33 | U10.16 15.77,83.33 | U10.17 15.7,83.73 | U10.18 15.77,84.13 | U10.19 15.77,84.53 | U10.15 11.17,84.53 | U10.13 11.2,83.73
  Top 0.3: v66.9,79.6 66.85,79.55 U7.35 63.9,79.55 C31.1 | 73.05,82.55 U7.8 75.15,82.55 | 72.15,76.65 U7.47 72.15,78.65 | 67.65,84.85 U7.23 67.65,86.95 67.42,87.17 v66.95,87.17 | 72.15,78.65 v72,78.8 | 72.15,78.65 72.15,79.45
  other vias: 9.75,89 9.75,91.1 9.75,90.3 9.75,92 10.15,87.2 10.2,80.1 9.75,76.5 9.75,77.3 9.75,75.7 19.42,83.91 17.95,85.6 39.6,90.4 39.6,88.3 39.6,87.7 39.6,87.1 39.6,92.1 17.2,77.9 34.7,90.53 37.2,90.5 45.8,88.1 45.65,90.55 48.3,90.7 15.25,75.2 51.9,86.5 81,90 81,80 81,70 81,60 81,50 81,40 81,20 81,10 2,90 2,84 2,80 2,76 2,70 2,60 2,54 2,50 2,44 2,40 2,20 2,16 2,10 9.05,93.25 77.5,94.7 10.97,75.2 66.8,84.1 9.75,93.2 69.7,84.7 76.6,75.2 66.2,92.55 78.1,81.57 78.9,79.2 75.8,76.1 67.5,84.77 66.9,82.1 71.3,81.1 74.8,85.43 19.7,47.5 17.5,41.9 68.35,88.2 62.9,79.5 70.6,72 77,61.3 39.6,93.8 78.1,90.1 72.4,82.6 77.1,82.13 75.8,79.93 75.7,77.6 54,69.5 55,69.5 56,69.5 57,69.5 58,69.5 59,69.5 60,69.5 61,69.5 58,68.5 57.5,67.5 58,70.5 57,70.5 57,68.5 56,68.5 54,68.5 54,70.5 55,70.5 56,70.5 55,68.5 56.5,67.5 58.5,67.5 59.5,67.5 59,68.5 59,70.5 60,70.5 60,68.5 61,68.5 61,70.5 59,65.5 58,66.5 59,66.5 58,65.5 57,66.5 57,65.5 62,68.5 62,69.5 62,70.5 21,69.5 22,69.5 23,69.5 24,69.5 25,69.5 26,69.5 27,69.5 28,69.5 25,68.5 24.5,67.5 25,70.5 24,70.5 24,68.5 23,68.5 21,68.5 21,70.5 22,70.5 23,70.5 22,68.5 23.5,67.5 25.5,67.5 26.5,67.5 26,68.5 26,70.5 27,70.5 27,68.5 28,68.5 28,70.5 26,65.5 25,66.5 26,66.5 25,65.5 24,66.5 24,65.5 29,68.5 29,69.5 29,70.5 25,4.5 25,5.5 25,6.5 25,7.5 25,8.5 25,9.5 25,10.5 25,11.5 26,8.5 24,8.5 24,7.5 26,7.5 26,6.5 26,4.5 24,4.5 24,5.5 24,6.5 26,5.5 26,9.5 24,9.5 24,10.5 26,10.5 26,11.5 24,11.5 25,2.5 25,3.5 26,3.5 24,2.5 24,3.5 26,2.5 58,4.5 58,5.5 58,6.5 58,7.5 58,8.5 58,9.5 58,10.5 58,11.5 59,8.5 57,8.5 57,7.5 59,7.5 59,6.5 59,4.5 57,4.5 57,5.5 57,6.5 59,5.5 59,9.5 57,9.5 57,10.5 59,10.5 59,11.5 57,11.5 58,2.5 58,3.5 59,3.5 57,2.5 57,3.5 59,2.5 8.5,69.5 9.5,69.5 10.5,69.5 11.5,69.5 12.5,69.5 13.5,69.5 14.5,69.5 15.5,69.5 12.5,68.5 12.5,70.5 11.5,70.5 11.5,68.5 10.5,68.5 8.5,68.5 8.5,70.5 9.5,70.5 10.5,70.5 9.5,68.5 13.5,68.5 13.5,70.5 14.5,70.5 14.5,68.5 15.5,68.5 15.5,70.5 5.5,69.5 6.5,69.5 7.5,69.5 7.5,68.5 5.5,68.5 5.5,70.5 6.5,70.5 7.5,70.5 6.5,68.5 69.5,69.5 70.5,69.5 71.5,69.5 72.5,69.5 73.5,69.5 74.5,69.5 75.5,69.5 76.5,69.5 73.5,68.5 73.5,70.5 72.5,70.5 72.5,68.5 71.5,68.5 69.5,68.5 69.5,70.5 70.5,70.5 71.5,70.5 70.5,68.5 74.5,68.5 74.5,70.5 75.5,70.5 75.5,68.5 76.5,68.5 76.5,70.5 66.5,69.5 67.5,69.5 68.5,69.5 68.5,68.5 66.5,68.5 66.5,70.5 67.5,70.5 68.5,70.5 67.5,68.5 77.5,68.5 77.5,69.5 77.5,70.5 57,1.5 58,1.5 59,1.5 24,1.5 25,1.5 26,1.5 27,2.5 16,1.5 17,1.5 18,1.5 19,1.5 20,1.5 21,1.5 22,1.5 23,1.5 20,2.5 19,2.5 16,2.5 17,2.5 18,2.5 21,2.5 22,2.5 23,2.5 13,1.5 14,1.5 15,1.5 13,2.5 14,2.5 15,2.5 31,1.5 32,1.5 33,1.5 34,1.5 35,1.5 36,1.5 37,1.5 35,2.5 34,2.5 31,2.5 32,2.5 33,2.5 36,2.5 37,2.5 28,1.5 29,1.5 30,1.5 28,2.5 29,2.5 30,2.5 27,1.5 9,1.5 10,1.5 11,1.5 12,1.5 12,2.5 9,2.5 10,2.5 11,2.5 7,1.5 8,1.5 6,2.5 7,2.5 8,2.5 49,1.5 50,1.5 51,1.5 52,1.5 53,1.5 54,1.5 55,1.5 56,1.5 53,2.5 52,2.5 49,2.5 50,2.5 51,2.5 54,2.5 55,2.5 56,2.5 46,1.5 47,1.5 48,1.5 46,2.5 47,2.5 48,2.5 42,1.5 43,1.5 44,1.5 45,1.5 45,2.5 42,2.5 43,2.5 44,2.5 39,1.5 40,1.5 41,1.5 39,2.5 40,2.5 41,2.5 70,1.5 71,1.5 72,1.5 73,1.5 74,1.5 75,1.5 76,1.5 77,1.5 74,2.5 73,2.5 70,2.5 71,2.5 72,2.5 75,2.5 76,2.5 77,2.5 67,1.5 68,1.5 69,1.5 67,2.5 68,2.5 69,2.5 63,1.5 64,1.5 65,1.5 66,1.5 66,2.5 63,2.5 64,2.5 65,2.5 60,1.5 61,1.5 62,1.5 60,2.5 61,2.5 62,2.5 38,2.5 38,1.5 25,97.5 24,97.5 26,97.5 58,97.5 57,97.5 59,97.5 57,96.5 58,96.5 59,96.5 24,96.5 25,96.5 26,96.5 27,97.5 16,96.5 17,96.5 18,96.5 19,96.5 20,96.5 21,96.5 22,96.5 23,96.5 20,97.5 19,97.5 16,97.5 17,97.5 18,97.5 21,97.5 22,97.5 23,97.5 13,96.5 14,96.5 15,96.5 13,97.5 14,97.5 15,97.5 31,96.5 32,96.5 33,96.5 34,96.5 35,96.5 36,96.5 37,96.5 35,97.5 34,97.5 31,97.5 32,97.5 33,97.5 36,97.5 37,97.5 28,96.5 29,96.5 30,96.5 28,97.5 29,97.5 30,97.5 27,96.5 9,96.5 10,96.5 11,96.5 12,96.5 12,97.5 9,97.5 10,97.5 11,97.5 6,96.5 7,96.5 8,96.5 6,97.5 7,97.5 8,97.5 49,96.5 50,96.5 51,96.5 52,96.5 53,96.5 54,96.5 55,96.5 56,96.5 53,97.5 52,97.5 49,97.5 50,97.5 51,97.5 54,97.5 55,97.5 56,97.5 46,96.5 47,96.5 48,96.5 46,97.5 47,97.5 48,97.5 42,96.5 43,96.5 44,96.5 45,96.5 45,97.5 42,97.5 43,97.5 44,97.5 39,96.5 40,96.5 41,96.5 39,97.5 40,97.5 41,97.5 70,96.5 71,96.5 72,96.5 73,96.5 74,96.5 75,96.5 76,96.5 77,96.5 74,97.5 73,97.5 70,97.5 71,97.5 72,97.5 75,97.5 76,97.5 77,97.5 67,96.5 68,96.5 69,96.5 67,97.5 68,97.5 69,97.5 63,96.5 64,96.5 65,96.5 66,96.5 66,97.5 63,97.5 64,97.5 65,97.5 60,96.5 61,96.5 62,96.5 60,97.5 61,97.5 62,97.5 38,97.5 38,96.5 2,92 2,88 2,86 2,82 2,78 2,74 2,72 2,68 2,62 2,58 2,56 2,52 2,48 2,46 2,42 2,38 2,32 2,22 2,18 2,14 2,12 2,8 2,2 4,2 2,98 4,98 79,98 81,98 81,92 81,88 81,86 81,84 81,82 81,78 81,76 81,74 81,72 81,68 81,62 81,58 81,56 81,54 81,52 81,48 81,46 81,44 81,42 81,38 81,32 81,22 81,18 81,16 81,14 81,12 81,8 81,2 79,2 9,61 10,61 10,64 6,64 6,61 66,65.6 67.6,95.6 67.6,94.8 76.25,95.5 76.25,94.6 76.35,87.55 73.65,87.55 71.7,89.25 70,94.1 72,94.1 74,94.1 72.8,91.3 68,92.3 67.3,90.2 70.1,91 64.7,89.2 62.5,84.67 64.62,87.58 19.3,49.4 17,49.2 17.1,47.8 17,46.3 18.9,86.8 17.8,88.8 19.5,87.3 13.1,84.45 14.15,84.4 13.07,83.42 14.12,83.4 13.6,83.9 16.07,83.78 11.1,83.9 75,36.5 71.3,37.8 70.7,37.8 66.4,31.7 69.8,31.4 73.1,33 68.5,42 73.3,40.8 74.8,41.3 76.8,36.7 66.4,43.5 18.5,56.5 20.3,57.3
  pour Bottom (isolate 0.2, rank 6): 81,0 2,0 arc-90 0,2 0,98 arc-90 2,100 81,100 arc-90 83,98 83,2 arc-90
  pour Top (isolate 0.2, rank 6): 81,0 2,0 arc-90 0,2 0,98 arc-90 2,100 81,100 arc-90 83,98 83,2 arc-90
HASP_ANALOG_1
  Top 0.3: TP5.1 17.3,32 16.9,32.4 R4.2
  Bottom 0.3: J3.6 43,35 40,32 TP5.1
HASP_ANALOG_2
  Top 0.3: TP4.1 R3.2
  Bottom 0.3: TP4.1 23.1,33.9 24,33 38,33 40,35 J3.5
HASP_DISCRETE_1
  Top 0.3: TP14.1 J3.18
HASP_DISCRETE_2
  Top 0.3: TP16.1 J3.17
HASP_DISCRETE_3
  Top 0.3: TP23.1 J3.16
HASP_DISCRETE_4
  Top 0.3: TP24.1 J3.15
HASP_SERIAL_RX  (via drill 0.25)
  Top 0.3: TP12.1 J3.20 | U2.13 71.22,37.12 v71,36.9
  Bottom 0.3: J3.20 61.6,42 66.7,36.9 v71,36.9
HASP_SERIAL_TX
  Top 0.3: J3.10 TP10.1 60.6,35.2 61.5,34.3 64.59,34.3 64.81,34.52 U2.8
N$1  (via drill 0.25)
  Top 0.2: v16.54,45.3 16.59,45.35 J2.1 J2.2
  Bottom 0.2: TP8.1 6.51,32.5 16.54,42.52 v16.54,45.3
N$2
  Bottom 0.4: U3.4 41.8,58.55 R5.2
N$3
  Top 0.3: R3.1 C3.1 R7.2
N$4
  Top 0.3: R4.1 C2.1 R8.2
N$5
  Bottom 0.3: U3.1 50.33,49.9 50.1,49.9 50.2,49.8 R10.2 TP30.1
N$6
  Top 0.3: R14.1 U2.16
N$7
  Top 0.3: U2.7 66.72,35.17 67.5,34.4 C10.1
N$8
  Top 0.3: U2.3 66.92,37.77 68.8,35.9 C9.1
N$9
  Top 0.3: U2.6 64.62,35.83 64.5,35.7 64,35.7 63.8,35.5 C14.2
N$10
  Top 0.3: U2.5 64.67,36.48 64.6,36.4 C14.1
N$11
  Top 0.3: U2.4 64.67,37.12 64.6,37.2 C11.2
N$12
  Top 0.3: U2.2 64.78,38.42 64.6,38.6 C11.1
N$13
  Top 0.3: U2.9 74.28,34.52 R12.1
N$14  (via drill 0.25)
  Top 0.2: R21.2 v76.9,63.1
  Bottom 0.2: v76.9,63.1 77.98,63.1 D4.A
N$15
  Top 0.3: U2.12 73.62,36.48 R16.1
N$17
  Top 0.3: U2.10 71.58,35.17 70.9,34.5 TP31.1
N$18
  Top 0.3: U2.1 TP32.1
N$19  (via drill 0.25)
  Top 0.2: R23.1 v78.1,86.3
  Bottom 0.2: v78.1,86.3 D6.A
NRESET  (via drill 0.25)
  Top 0.2: 65.3,64.9 65.3,60.91 60.48,56.09 24.79,56.09 19.7,51 19.7,50.5 19.05,49.85 J2.10 | 65.3,64.9 65.3,71.5 v69.9,76.1 | U7.7 71.05,82.05 70.3,81.3 v70.3,78.9 | TP13.1 65.3,64.9
  Bottom 0.2: v70.3,78.9 70.3,76.5 v69.9,76.1
PA0
  Top 0.2: U7.10 74.85,83.55 75.4,84.1 R23.2
PA2/USART2_TX  (via drill 0.25)
  Top 0.2: U7.12 72.5,84.55 69.6,81.64 v69.6,78.9 | v68.6,75.71 67.68,75.71 64.5,72.53 64.5,61.5 60.09,57.09 24.8,57.09 19.05,51.35 J2.13
  Top 0.3: U2.11 70.78,35.83 67.8,38.8 67.8,62.1 v67.6,62.3
  Bottom 0.2: v68.6,75.71 69.6,76.72 v69.6,78.9
  Bottom 0.3: v67.6,62.3 67.6,66.04 65.35,68.29 65.35,71.45 68.6,74.7 v68.6,75.71
PA3/USART2_RX  (via drill 0.25)
  Top 0.2: U7.13 72.65,85.19 68.91,81.45 v68.91,78.91 v68.9,78.9 | v68,75.1 64.9,72 64.9,61.1 60.44,56.64 24.84,56.64 19.05,50.85 J2.12
  Top 0.3: R12.2 75.7,33.6 73.7,31.6 70.5,31.6 69.8,32.3 69.8,36.1 67.2,38.7 67.2,61.5 v66.9,61.8
  Bottom 0.2: v68.9,78.9 68.9,78.3 68,77.4 v68,75.1
  Bottom 0.3: v66.9,61.8 66.9,66.1 64.9,68.1 64.9,72 v68,75.1
PA4/DAC0  (via drill 0.25)
  Top 0.2: v67.52,80.78 67.5,80.8 67.7,80.8 72.15,85.25 U7.14 72.15,86.88 72.16,86.89 72.16,87.06 72.35,87.25 74,88.9 TP25.1 | v63.19,72.9 63.29,72.8 63.29,62.09 59.75,58.55 29.95,58.55 v29.41,59.1 v29.4,59.1 | v21.4,50.2 21.4,43.6 16.9,39.1 R8.1
  Bottom 0.2: v67.52,80.78 62.98,80.78 61.3,79.1 61.3,74.9 63.3,72.9 v63.19,72.9 | v29.4,59.1 21.4,51.1 v21.4,50.2
PA5/DAC1  (via drill 0.25)
  Top 0.2: v71.66,87.1 v71.65,87.09 U7.15 71.65,85.25 67.7,81.3 v67.1,81.3 | v62.6,72.1 62.9,71.8 62.9,62.3 59.6,59 59.51,58.91 30.7,58.91 30.59,58.91 v30.4,59.1 | R7.1 22,50.9 v22.7,51.6
  Bottom 0.2: v71.66,87.1 75.96,91.4 TP15.1 | v62.6,72.1 62.6,72.2 60.8,74 60.8,79.2 62.9,81.3 v67.1,81.3 | v22.7,51.6 22.9,51.6 v30.4,59.1
PA6  (via drill 0.25)
  Top 0.2: U7.16 v71.15,87.55
  Bottom 0.2: v71.15,87.55 76.8,93.2 TP22.1
SWCLK
  Top 0.2: U7.37 66.65,77.55 63.7,74.6 63.7,61.9 59.9,58.1 24.8,58.1 19.05,52.35 J2.15
SWDIO  (via drill 0.25)
  Top 0.2: U7.34 64.32,80.05 62.55,80.05 62.2,79.7 v62.2,75.9 | v64.3,73.8 64.09,73.59 64.09,61.7 59.85,57.45 24.65,57.45 19.05,51.85 18.3,51.85 J2.14
  Bottom 0.2: v64.3,73.8 v62.2,75.9
SWO  (via drill 0.25)
  Top 0.2: v16.19,51.73 16.19,51.74 17.29,52.85 J2.16
  Bottom 0.2: TP21.1 7.62,34.1 16.03,42.52 16.03,51.58 v16.19,51.73
TPS-EN
  Top 0.2: U10.4 14.1,81.89 14.48,81.5 15.7,81.5 16.2,81 R13.1 | R13.1 18.5,80.05 TP29.1 | R11.2 R13.1
TPS-FB
  Top 0.2: U10.8 13.6,86 13.95,86.35 R2.2 | TP27.1 19.58,85.2 17.69,87.09 17.33,87.09 17.2,87.22 C22.1
  Top 0.5: R2.2 15.85,87.1 16.15,87.4 R1.1
  pour Top (no thermals): 15.9,88.8 16.4,88.8 16.8,88.4 17.5,88.4 17.5,87.5 15.9,87.5
TPS-L1
  pour Top (isolate 0.2, no thermals): 8.75,83.1 10,83.1 10.2,82.9 12.71,82.9 12.66,82 8.75,82
TPS-L2
  pour Top (isolate 0.2, no thermals): 12.75,84.9 8.75,84.9 8.75,85.8 12.75,85.8
TPS-PG
  Top 0.2: R9.1 18.2,89.5 21.3,86.4 21.3,83.65 20.1,82.45 17.35,82.45 | TP26.1 17.35,82.45 | 17.35,82.45 U10.5
TPS-VAUX
  Top 0.2: U10.6 15.7,85.41 16.35,84.75 C7.1 16.9,83.8 17.4,83.3 TP28.1
TPS-VIN
  Top 0.2: R18.1 12.8,76.75 C12.1 | U10.2 13.1,80.6
  Top 0.305: R13.2 14.8,76.7
  Top 0.7: R6.2 24.1,82.7 19.1,77.7 18.5,77.7 17.5,76.7 14.8,76.7
  pour Top (isolate 0.2, rank 2, no thermals): 12.75,81.2 12.15,80.6 12.15,74.9 15.15,74.9 15.15,81.2
TPS-VOUT-3.3V
  Top 0.2: U10.9 13.1,86.5
  Top 0.5: C23.1 TP6.1
  pour Top (isolate 0.2, rank 2, no thermals): 12.95,86.1 12.4,86.65 12.15,86.65 12.15,93.7 15.15,93.7 15.15,86.1
VBUS  (via drill 0.35)
  Top 0.7: CF1.6 CF1.5 40.87,87.42 40.87,82.7 | v42,79.6 40.87,80.73 40.87,82.7 | R6.1 40.87,82.7
  Bottom 0.2: C6.1 45.81,62.9 | C5.1 45.81,61.2
  Bottom 0.7: v40.9,80.7 v42,79.6 45.81,75.79 45.81,70.31 45.81,65.61 | U3.5 45.81,61.2 45.81,62.9 TP3.1
  Bottom 1: TP3.1 45.81,65.61
XTAL1-IN
  Top 0.2: U7.5 74.77,81.05 75.17,80.65 75.17,79.28 76.05,78.4 77.45,78.4 77.92,77.92 X1.1 77.92,76.92 78,76.85 C28.1
XTAL1-OUT
  Top 0.2: X1.3 76.6,79.3 C27.1 75.75,80.7 74.9,81.55 U7.6

### Text on the board
tPlace: PA6 | PA5 | !SHDN | VBUS | VMPPT | LT-EN | !SHDN-3.3V | IADJ | BOOT0 | NRST | POPULATE ON / +Z+X SOLAR / BOARD ONLY | D3 | D2 | D1 | D0 | SWO | OreSat1B HASP INTERFACE v1 | 2020/07/18 | Frame v1.1
bPlace: 3.3V | 3.3V | PA6 | PA5 | PA0 | !SHDN-3.3V | BOOT0 | OreSat1B HASP Interface v1 | Frame v1.1 | 2021/07/18 | NRST | 3.3V | D3 | D2 | D1 | D0 | SDO
tDocu: NOTE: See DXF layer for component / placement restrictions